# Altium project PCB_RFID-Project.PrjPcb
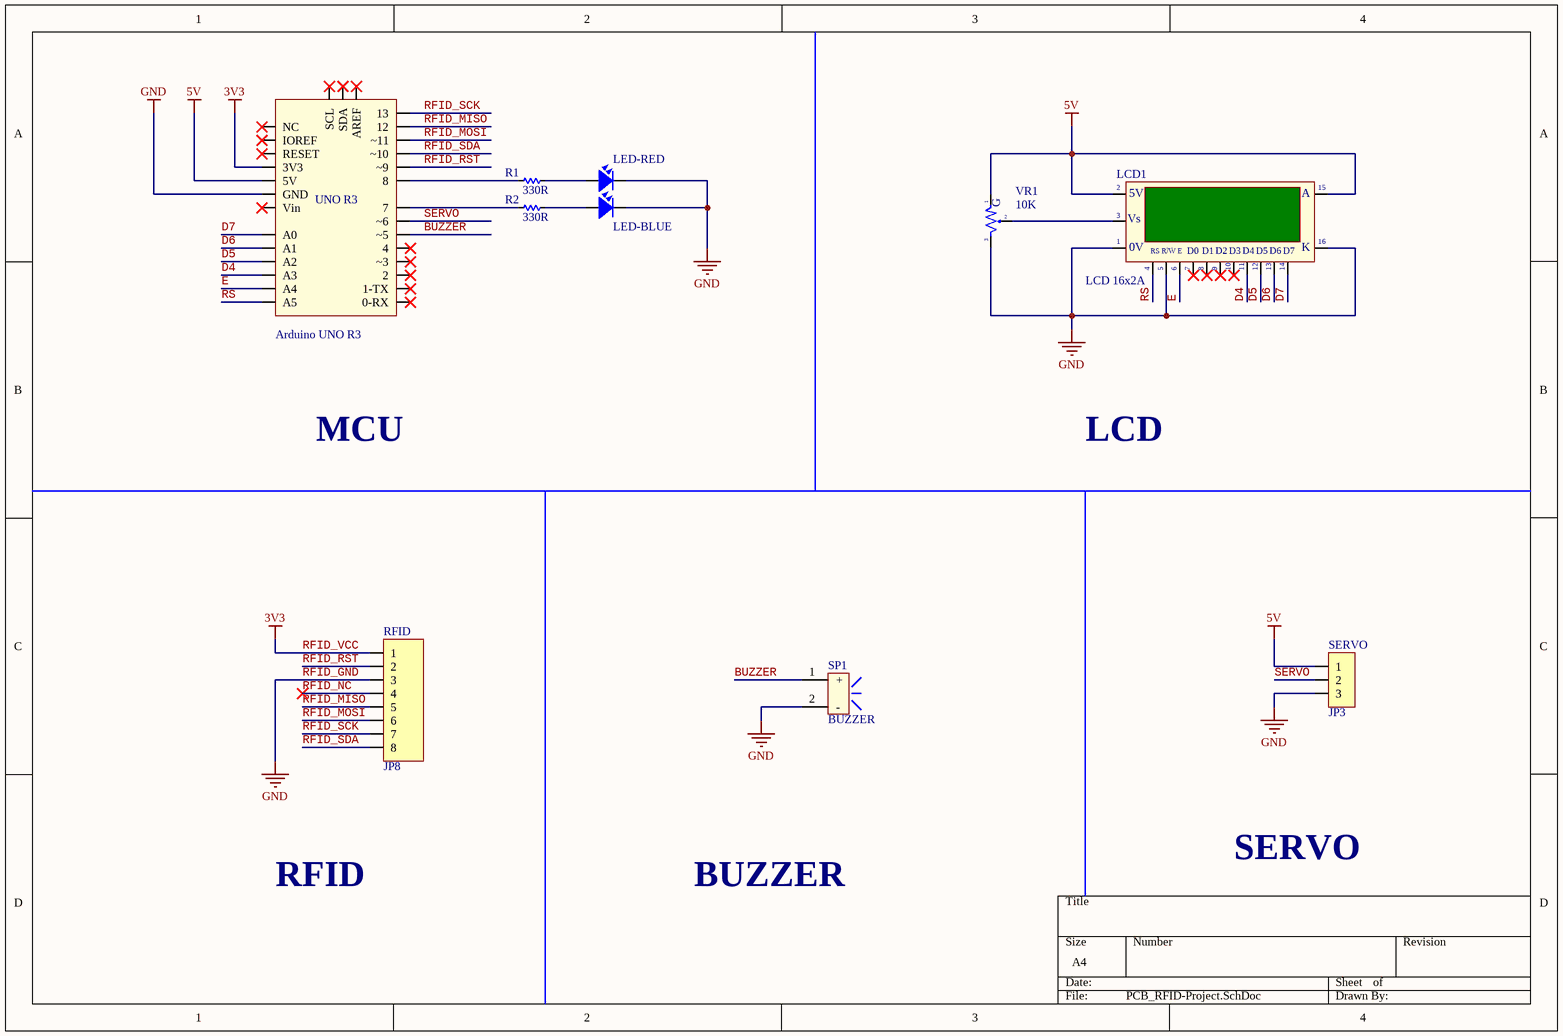
[diagram p0: PCB_RFID-Project.SchDoc]
1 sheet, 10 parts. Net scope: global (net labels, ports and power ports of the same name join across sheets).
Board file: PCB_RFID-Project.PcbDoc

## Sheet PCB_RFID-Project.SchDoc
size A4

### Parts
Arduino_UNO_R3  Arduino Uno R3  [Arduino UNO R3]  (value not drawn)
LCD1  LCD 16x2A  [LCD16X2]
LED-BLUE  LED  [LED-5MM-BLUE]  (value not drawn)
LED-RED  LED  [LED-5MM-RED]  (value not drawn)
R1  330R  [RES-1/4W]
R2  330R  [RES-1/4W]
RFID  JP8  [JP8-D1T]
SERVO  JP3  [JP3-D1T]
SP1  BUZZER  [Buzzer 5V 9x1.2mm]
VR1  10K  [VR-S2]

### Nets
5V: Arduino_UNO_R3.5V LCD1.2(VDD) LCD1.15(A) SERVO.1 VR1.1
RFID_GND: Arduino_UNO_R3.GND LCD1.1(GND) LCD1.5(R/~{W}) LCD1.16(K) LED-BLUE.2 LED-RED.2 RFID.3 SERVO.3 SP1.2(-) VR1.3  [also labelled GND]
RFID_VCC: Arduino_UNO_R3.3V3 RFID.1  [also labelled 3V3]
BUZZER: Arduino_UNO_R3.~5 SP1.1(+)
D4: Arduino_UNO_R3.A3 LCD1.11(D4)
D5: Arduino_UNO_R3.A2 LCD1.12(D5)
D6: Arduino_UNO_R3.A1 LCD1.13(D6)
D7: Arduino_UNO_R3.A0 LCD1.14(D7)
E: Arduino_UNO_R3.A4 LCD1.6(~{EN})
RFID_MISO: Arduino_UNO_R3.12 RFID.5
RFID_MOSI: Arduino_UNO_R3.~11 RFID.6
RFID_NC: RFID.4
RFID_RST: Arduino_UNO_R3.~9 RFID.2
RFID_SCK: Arduino_UNO_R3.13 RFID.7
RFID_SDA: Arduino_UNO_R3.~10 RFID.8
RS: Arduino_UNO_R3.A5 LCD1.4(RS)
SERVO: Arduino_UNO_R3.~6 SERVO.2
NetArduino_UNO_R3_7: Arduino_UNO_R3.7 R2.2
NetArduino_UNO_R3_8: Arduino_UNO_R3.8 R1.2
NetLCD1_3: LCD1.3(VEE) VR1.2
NetLED-BLUE_1: LED-BLUE.1 R2.1
NetLED-RED_1: LED-RED.1 R1.1

Not connected (* = marked no-connect by the designer): Arduino_UNO_R3 0-RX* 1-TX* 2* 4* AREF* IOREF* NC* RESET* SCL* SDA* Vin* ~3*; LCD1 7(D0)* 8(D1)* 9(D2)* 10(D3)*

### Notes on the sheet
- MCU
- LCD
- RFID
- BUZZER
- SERVO
- (in symbol Arduino Uno R3) UNO R3
- (in symbol LCD16x2A) 5V; Vs; |; 0V; R/W; E
- (in symbol VR-S) G

### Library data of the parts
Arduino_UNO_R3 = Arduino Uno R3: Value: Cau 1A
LCD1 = LCD16x2A: LCD dipslay 16 char, 2 line; Value: LCD16x2A
LED-BLUE LED-RED = LED: LED Single colour Green and Red; Value: LED 3 ly Single Colour
R1 R2 = Res: Manufacturer: Generic Components; Class: Passive; SubClass: R; Published: 08/06/2000; Publisher: Altium Hobart Technology Centre
RFID = JP8: WR-PHD 2.54 mm Angled Socket Header; Manufacturer: W¨¹rth Elektronik eiSos GmbH; partNo: 613008143121; ComponentLink1 Description: Manufacturer; ComponentLink2 Description: Datasheet; NoPins: 08; Created Date: 29 March 2013; ComponentLink1URL: http://www.we-online.com; ComponentLink2URL: http://katalog.we-online.de/em/datasheet/6130xx143121.pdf; Created by: Karrer Zheng
SERVO = JP3: WR-PHD 2.54 mm Angled Socket Header; Manufacturer: W¨¹rth Elektronik eiSos GmbH; partNo: 613003143121; ComponentLink1 Description: Manufacturer; ComponentLink2 Description: Datasheet; NoPins: 03; Created Date: 29 March 2013; ComponentLink1URL: http://www.we-online.com; ComponentLink2URL: http://katalog.we-online.de/em/datasheet/6130xx143121.pdf; Created by: Karrer Zheng
SP1 = Speaker: Buzzer through hole (3V3/5V/12V)
VR1 = VR-S: Var Resistor; Value: Volume 50k